# EAGLE design BMS Bottom Segment (EAGLE 7.7.0)
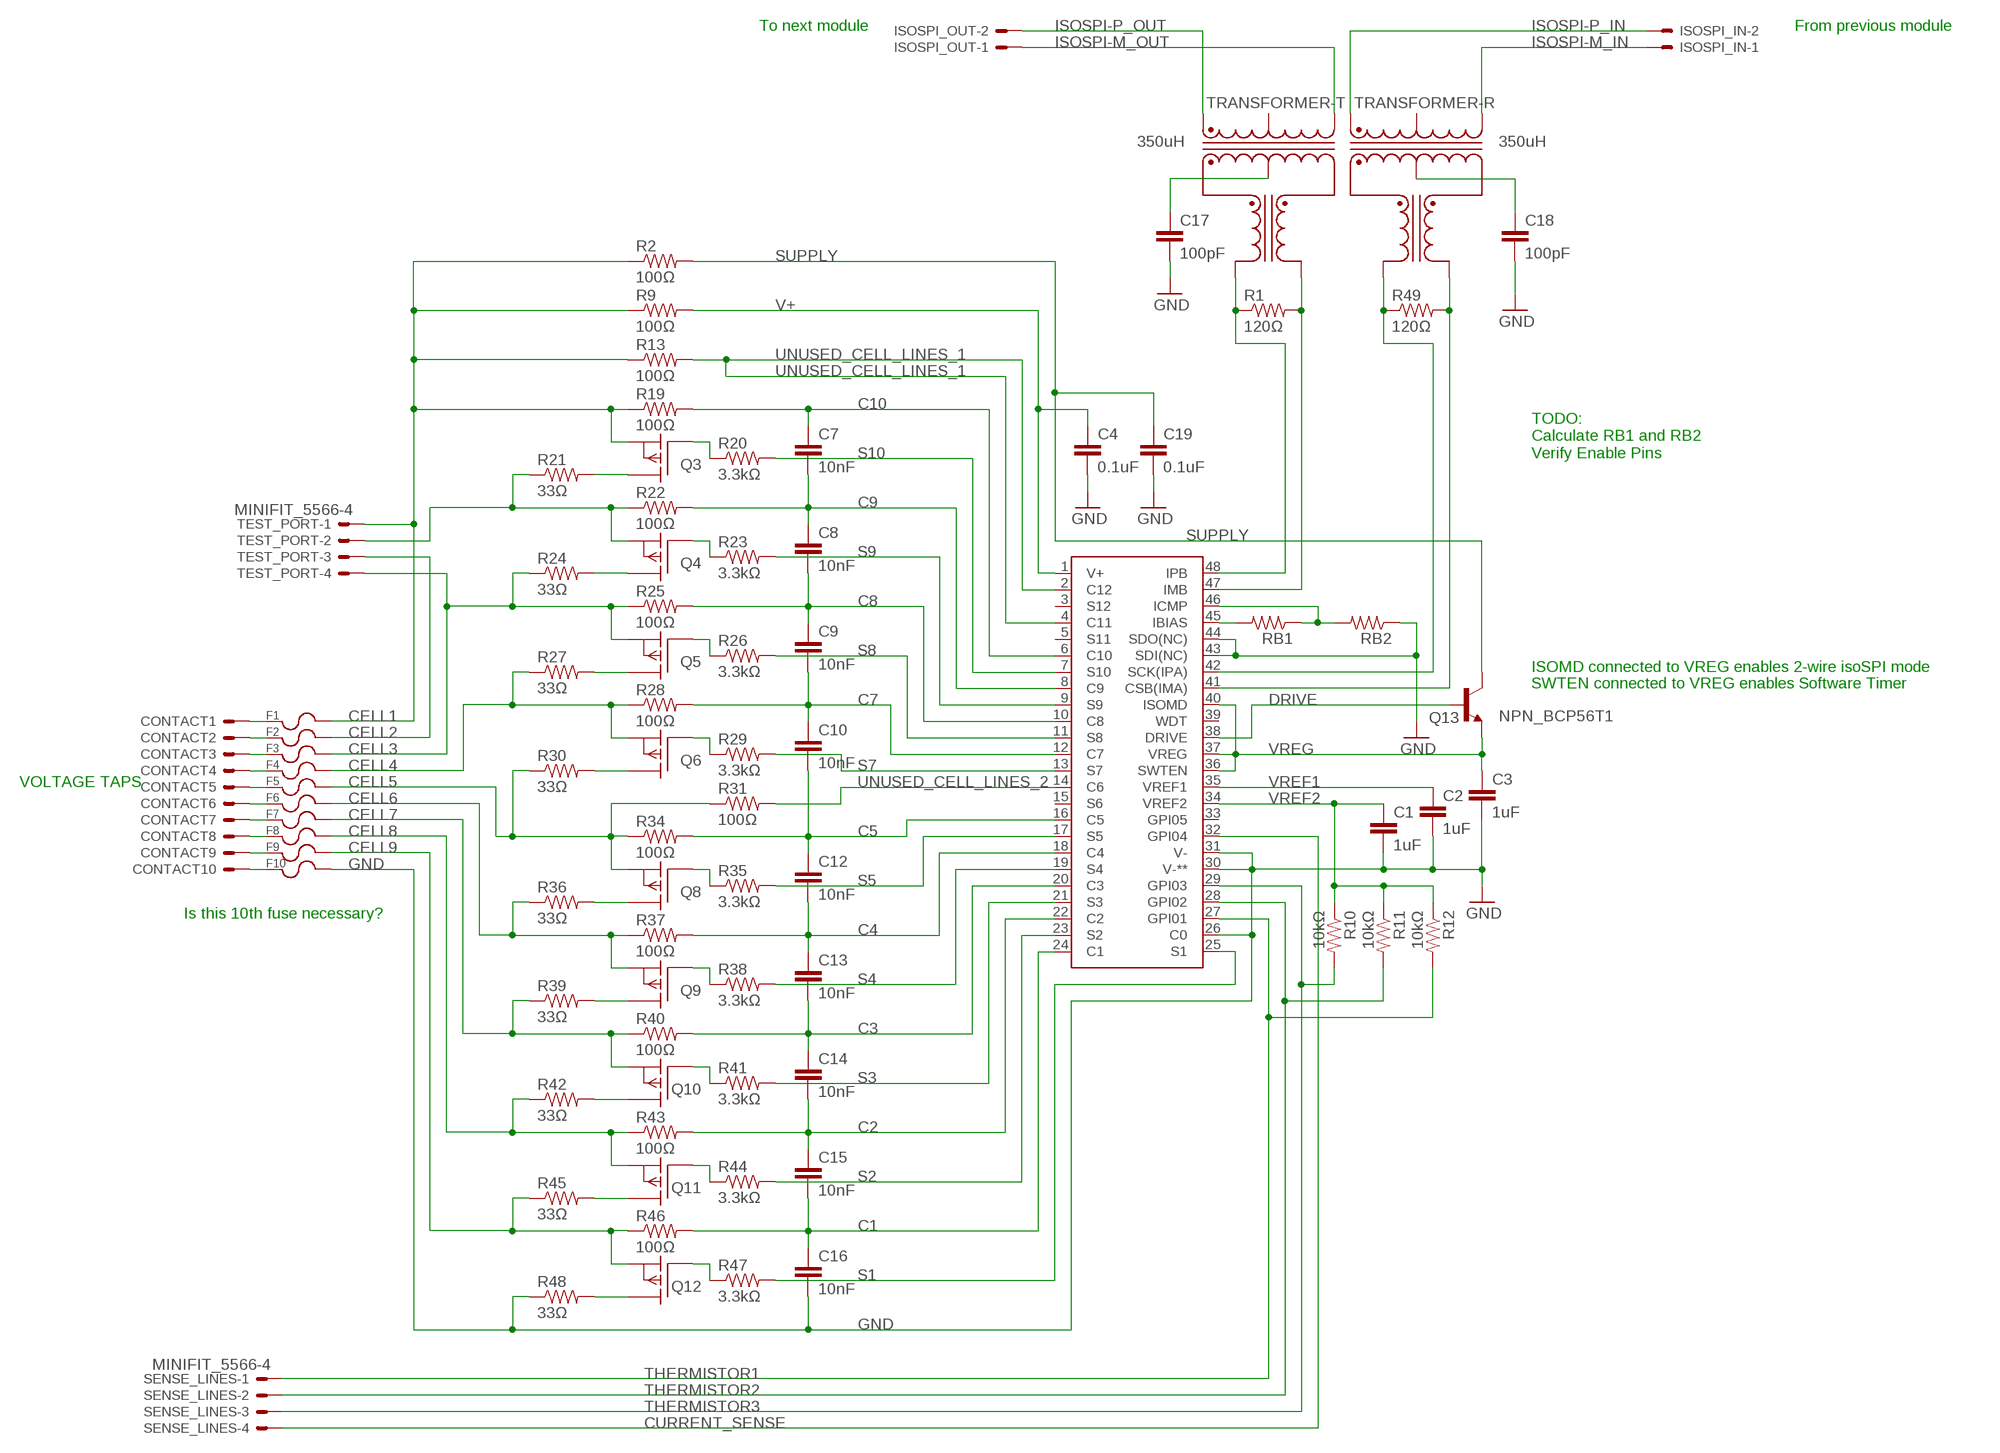
[diagram p0: schematic, sheet 1]

## Parts
C1  1uF  CAP0805  [0805]
C2  1uF  CAP0805  [0805]
C3  1uF  CAP0805  [0805]
C4  0.1uF  CAP0805  [0805]
C7  10nF  CAP0805  [0805]
C8  10nF  CAP0805  [0805]
C9  10nF  CAP0805  [0805]
C10  10nF  CAP0805  [0805]
C12  10nF  CAP0805  [0805]
C13  10nF  CAP0805  [0805]
C14  10nF  CAP0805  [0805]
C15  10nF  CAP0805  [0805]
C16  10nF  CAP0805  [0805]
C17  100pF  CAP0805  [0805]
C18  100pF  CAP0805  [0805]
C19  0.1uF  CAP0805  [0805]
CONTACT1  SPRING_CONTACT  [S1791-42R]
CONTACT2  SPRING_CONTACT  [S1791-42R]
CONTACT3  SPRING_CONTACT  [S1791-42R]
CONTACT4  SPRING_CONTACT  [S1791-42R]
CONTACT5  SPRING_CONTACT  [S1791-42R]
CONTACT6  SPRING_CONTACT  [S1791-42R]
CONTACT7  SPRING_CONTACT  [S1791-42R]
CONTACT8  SPRING_CONTACT  [S1791-42R]
CONTACT9  SPRING_CONTACT  [S1791-42R]
CONTACT10  SPRING_CONTACT  [S1791-42R]
F1  0751.0110_FUSE_CLIP  [0751.0110]
F2  0751.0110_FUSE_CLIP  [0751.0110]
F3  0751.0110_FUSE_CLIP  [0751.0110]
F4  0751.0110_FUSE_CLIP  [0751.0110]
F5  0751.0110_FUSE_CLIP  [0751.0110]
F6  0751.0110_FUSE_CLIP  [0751.0110]
F7  0751.0110_FUSE_CLIP  [0751.0110]
F8  0751.0110_FUSE_CLIP  [0751.0110]
F9  0751.0110_FUSE_CLIP  [0751.0110]
F10  0751.0110_FUSE_CLIP  [0751.0110]
ISOSPI_IN  MINIFIT_5566-2  [MINIFIT_5566-2]
ISOSPI_OUT  MINIFIT_5566-2  [MINIFIT_5566-2]
Q3  P-CHANNEL_MOSFET_DMP3099L-7  [SOT23]
Q4  P-CHANNEL_MOSFET_DMP3099L-7  [SOT23]
Q5  P-CHANNEL_MOSFET_DMP3099L-7  [SOT23]
Q6  P-CHANNEL_MOSFET_DMP3099L-7  [SOT23]
Q8  P-CHANNEL_MOSFET_DMP3099L-7  [SOT23]
Q9  P-CHANNEL_MOSFET_DMP3099L-7  [SOT23]
Q10  P-CHANNEL_MOSFET_DMP3099L-7  [SOT23]
Q11  P-CHANNEL_MOSFET_DMP3099L-7  [SOT23]
Q12  P-CHANNEL_MOSFET_DMP3099L-7  [SOT23]
Q13  NPN_BCP56T1  [SOT223]
R1  120Ω  RESISTOR0805-RES  [0805]
R2  100Ω  RESISTOR0805-RES  [0805]
R9  100Ω  RESISTOR0805-RES  [0805]
R10  10kΩ  RESISTOR0805-RES  [0805]
R11  10kΩ  RESISTOR0805-RES  [0805]
R12  10kΩ  RESISTOR0805-RES  [0805]
R13  100Ω  RESISTOR0805-RES  [0805]
R19  100Ω  RESISTOR0805-RES  [0805]
R20  3.3kΩ  RESISTOR0805-RES  [0805]
R21  33Ω  RESISTOR2512  [R2512]
R22  100Ω  RESISTOR0805-RES  [0805]
R23  3.3kΩ  RESISTOR0805-RES  [0805]
R24  33Ω  RESISTOR2512  [R2512]
R25  100Ω  RESISTOR0805-RES  [0805]
R26  3.3kΩ  RESISTOR0805-RES  [0805]
R27  33Ω  RESISTOR2512  [R2512]
R28  100Ω  RESISTOR0805-RES  [0805]
R29  3.3kΩ  RESISTOR0805-RES  [0805]
R30  33Ω  RESISTOR2512  [R2512]
R31  100Ω  RESISTOR0805-RES  [0805]
R34  100Ω  RESISTOR0805-RES  [0805]
R35  3.3kΩ  RESISTOR0805-RES  [0805]
R36  33Ω  RESISTOR2512  [R2512]
R37  100Ω  RESISTOR0805-RES  [0805]
R38  3.3kΩ  RESISTOR0805-RES  [0805]
R39  33Ω  RESISTOR2512  [R2512]
R40  100Ω  RESISTOR0805-RES  [0805]
R41  3.3kΩ  RESISTOR0805-RES  [0805]
R42  33Ω  RESISTOR2512  [R2512]
R43  100Ω  RESISTOR0805-RES  [0805]
R44  3.3kΩ  RESISTOR0805-RES  [0805]
R45  33Ω  RESISTOR2512  [R2512]
R46  100Ω  RESISTOR0805-RES  [0805]
R47  3.3kΩ  RESISTOR0805-RES  [0805]
R48  33Ω  RESISTOR2512  [R2512]
R49  120Ω  RESISTOR0805-RES  [0805]
RB1  RESISTOR0805-RES  [0805]
RB2  RESISTOR0805-RES  [0805]
SENSE_LINES  MINIFIT_5566-4  [MINIFIT_5566-4]
TEST_PORT  MINIFIT_5566-4  [MINIFIT_5566-4]
TRANSFORMER-  350uH  TRANSFORMER_749010013  [749010013]
U$2  LTC6804-1  [LTC6804]

## Nets
C1: C15.2 C16.1 R46.2 U$2.24(C1)
C2: C14.2 C15.1 R43.2 U$2.22(C2)
C3: C13.2 C14.1 R40.2 U$2.20(C3)
C4: C12.2 C13.1 R37.2 U$2.18(C4)
C5: C10.2 C12.1 R34.2 U$2.16(C5)
C7: C9.2 C10.1 R28.2 U$2.12(C7)
C8: C8.2 C9.1 R25.2 U$2.10(C8)
C9: C7.2 C8.1 R22.2 U$2.8(C9)
C10: C7.1 R19.2 U$2.6(C10)
CELL1: F1.R1 F1.R2 Q3.2(S) R2.1 R9.1 R13.1 R19.1 TEST_PORT.1
CELL2: F2.R1 F2.R2 Q4.2(S) R21.1 R22.1 TEST_PORT.2 TEST_PORT.3
CELL3: F3.R1 F3.R2 Q5.2(S) R24.1 R25.1 TEST_PORT.4
CELL4: F4.R1 F4.R2 Q6.2(S) R27.1 R28.1
CELL5: F5.R1 F5.R2 Q8.2(S) R30.1 R31.1 R34.1
CELL6: F6.R1 F6.R2 Q9.2(S) R36.1 R37.1
CELL7: F7.R1 F7.R2 Q10.2(S) R39.1 R40.1
CELL8: F8.R1 F8.R2 Q11.2(S) R42.1 R43.1
CELL9: F9.R1 F9.R2 Q12.2(S) R45.1 R46.1
CURRENT_SENSE: SENSE_LINES.4 U$2.32(GPI04)
DRIVE: Q13.1(BASE) U$2.38(DRIVE)
GND: C1.2 C2.2 C3.2 C4.2 C16.2 C17.2 C18.2 C19.2 F10.R1 F10.R2 R48.1 RB2.1 U$2.26(C0) U$2.30(V-**) U$2.31(V-) U$2.43(SDI(NC)) U$2.44(SDO(NC))
ISOSPI-M_IN: ISOSPI_IN.1 TRANSFORMER-.8(R:D-)
ISOSPI-M_OUT: ISOSPI_OUT.1 TRANSFORMER-.3(T:D-)
ISOSPI-P_IN: ISOSPI_IN.2 TRANSFORMER-.6(R:D+)
ISOSPI-P_OUT: ISOSPI_OUT.2 TRANSFORMER-.1(T:D+)
N$1: C18.1 TRANSFORMER-.10(R:CX)
N$2: C17.1 TRANSFORMER-.15(T:CX)
N$4: RB1.2 U$2.45(IBIAS)
N$5: R1.1 TRANSFORMER-.16(T:X+) U$2.48(IPB)
N$7: RB1.1 RB2.2 U$2.46(ICMP)
N$8: R49.1 TRANSFORMER-.11(R:X+) U$2.42(SCK(IPA))
N$9: R49.2 TRANSFORMER-.9(R:X-) U$2.41(CSB(IMA))
N$14: CONTACT1.P$1(S) F1.L1 F1.L2
N$15: Q3.1(G) R20.1
N$16: CONTACT2.P$1(S) F2.L1 F2.L2
N$17: CONTACT3.P$1(S) F3.L1 F3.L2
N$18: Q3.3(D) R21.2
N$19: CONTACT4.P$1(S) F4.L1 F4.L2
N$20: Q8.1(G) R35.1
N$22: Q9.1(G) R38.1
N$23: CONTACT5.P$1(S) F5.L1 F5.L2
N$24: CONTACT6.P$1(S) F6.L1 F6.L2
N$25: Q4.3(D) R24.2
N$26: CONTACT7.P$1(S) F7.L1 F7.L2
N$27: Q10.1(G) R41.1
N$28: Q11.1(G) R44.1
N$29: Q12.1(G) R47.1
N$30: Q5.3(D) R27.2
N$31: CONTACT8.P$1(S) F8.L1 F8.L2
N$32: CONTACT9.P$1(S) F9.L1 F9.L2
N$33: CONTACT10.P$1(S) F10.L1 F10.L2
N$36: Q6.3(D) R30.2
N$42: R1.2 TRANSFORMER-.14(T:X-) U$2.47(IMB)
N$43: Q8.3(D) R36.2
N$51: Q9.3(D) R39.2
N$53: Q10.3(D) R42.2
N$61: Q11.3(D) R45.2
N$66: Q12.3(D) R48.2
N$68: Q4.1(G) R23.1
N$69: Q5.1(G) R26.1
N$70: Q6.1(G) R29.1
S1: R47.2 U$2.25(S1)
S2: R44.2 U$2.23(S2)
S3: R41.2 U$2.21(S3)
S4: R38.2 U$2.19(S4)
S5: R35.2 U$2.17(S5)
S7: R29.2 U$2.13(S7)
S8: R26.2 U$2.11(S8)
S9: R23.2 U$2.9(S9)
S10: R20.2 U$2.7(S10)
SUPPLY: C19.1 Q13.2(COLLECTOR) Q13.4(COLLECTOR) R2.2
THERMISTOR1: R12.2 SENSE_LINES.1 U$2.27(GPI01)
THERMISTOR2: R11.2 SENSE_LINES.2 U$2.28(GPI02)
THERMISTOR3: R10.2 SENSE_LINES.3 U$2.29(GPI03)
UNUSED_CELL_LINES_1: R13.2 U$2.2(C12) U$2.4(C11)
UNUSED_CELL_LINES_2: R31.2 U$2.14(C6)
V+: C4.1 R9.2 U$2.1(V+)
VREF1: C2.1 U$2.35(VREF1)
VREF2: C1.1 R10.1 R11.1 R12.1 U$2.34(VREF2)
VREG: C3.1 Q13.3(EMITTER) U$2.36(SWTEN) U$2.37(VREG) U$2.40(ISOMD)
Unconnected: TRANSFORMER-.2(T:CD) TRANSFORMER-.7(R:CD) U$2.3(S12) U$2.5(S11) U$2.15(S6) U$2.33(GPI05) U$2.39(WDT)

## Notes on the sheet
- To next module | From previous module
- TODO:
  Calculate RB1 and RB2
  Verify Enable Pins
- ISOMD connected to VREG enables 2-wire isoSPI mode
- SWTEN connected to VREG enables Software Timer
- VOLTAGE TAPS
- Is this 10th fuse necessary?

## Library data of the parts
C1-C4 C7-C10 C12-C19 = HyTechDevices:CAP: Capacitor Standard 0603 ceramic capacitor, and 0.1" leaded capacitor.
CONTACT1-CONTACT10 = HyTechDevices:SPRING_CONTACT: Harwin Surface Mount Spring Contact Datasheet <http://www.mouser.com/ds/2/181/S1791-42R-351038.pdf>
F1-F10 = HyTechDevices:0751.0110_FUSE_CLIP: Schurter 0751.0110 Brass Fuse Clip Datasheet <http://www.mouser.com/ds/2/358/typ_OG__Clip__5x20-2553.pdf>
ISOSPI_IN ISOSPI_OUT = HyTechDevices:MINIFIT_5566-2: Mini-Fit Junior connector 2 pole Source: http://www.molex.com; OC_FARNELL: 1822072; OC_NEWARK: unknown
Q3-Q6 Q8-Q12 = HyTechDevices:P-CHANNEL_MOSFET_DMP3099L-7: Diodes Incorporated P-Channel Enhancement Mode MOSFET Datasheet <http://www.mouser.com/ds/2/115/DMP3099L-266220.pdf>
Q13 = HyTechDevices:NPN_BCP56T1: ON Semiconductor BCP56 Series NPN Silicon Epitaxial Transistor Datasheet <http://www.mouser.com/ds/2/308/BCP56T1-D-104805.pdf>
R1 R2 R9-R13 R19-R31 R34-R49 RB1 RB2 = HyTechDevices:RESISTOR: Resistor Basic schematic elements and footprints for 0603, 1206, and PTH resistors.
SENSE_LINES TEST_PORT = HyTechDevices:MINIFIT_5566-4: Mini-Fit Junior connector 4 pole Source: http://www.molex.com; OC_FARNELL: unknown; OC_NEWARK: unknown
TRANSFORMER- = HyTechDevices:TRANSFORMER_749010013: Wurth Electronics Midcom 749010013 10/100BaseTX Ethernet Transformer Datasheet <http://www.mouser.com/ds/2/445/749010013-311000.pdf> Mouser Page <http://www.mouser.com/ProductDetail/Wurth-Electronics-Midcom/749010013/?qs=40TFAHZMFvcjCZphxWYgVw%3D%3D>
U$2 = HyTechDevices:LTC6804-1: Linear Technology LTC6804-1 Multicell Battery Monitor Datasheet <http://cds.linear.com/docs/en/datasheet/680412fc.pdf>

## Board
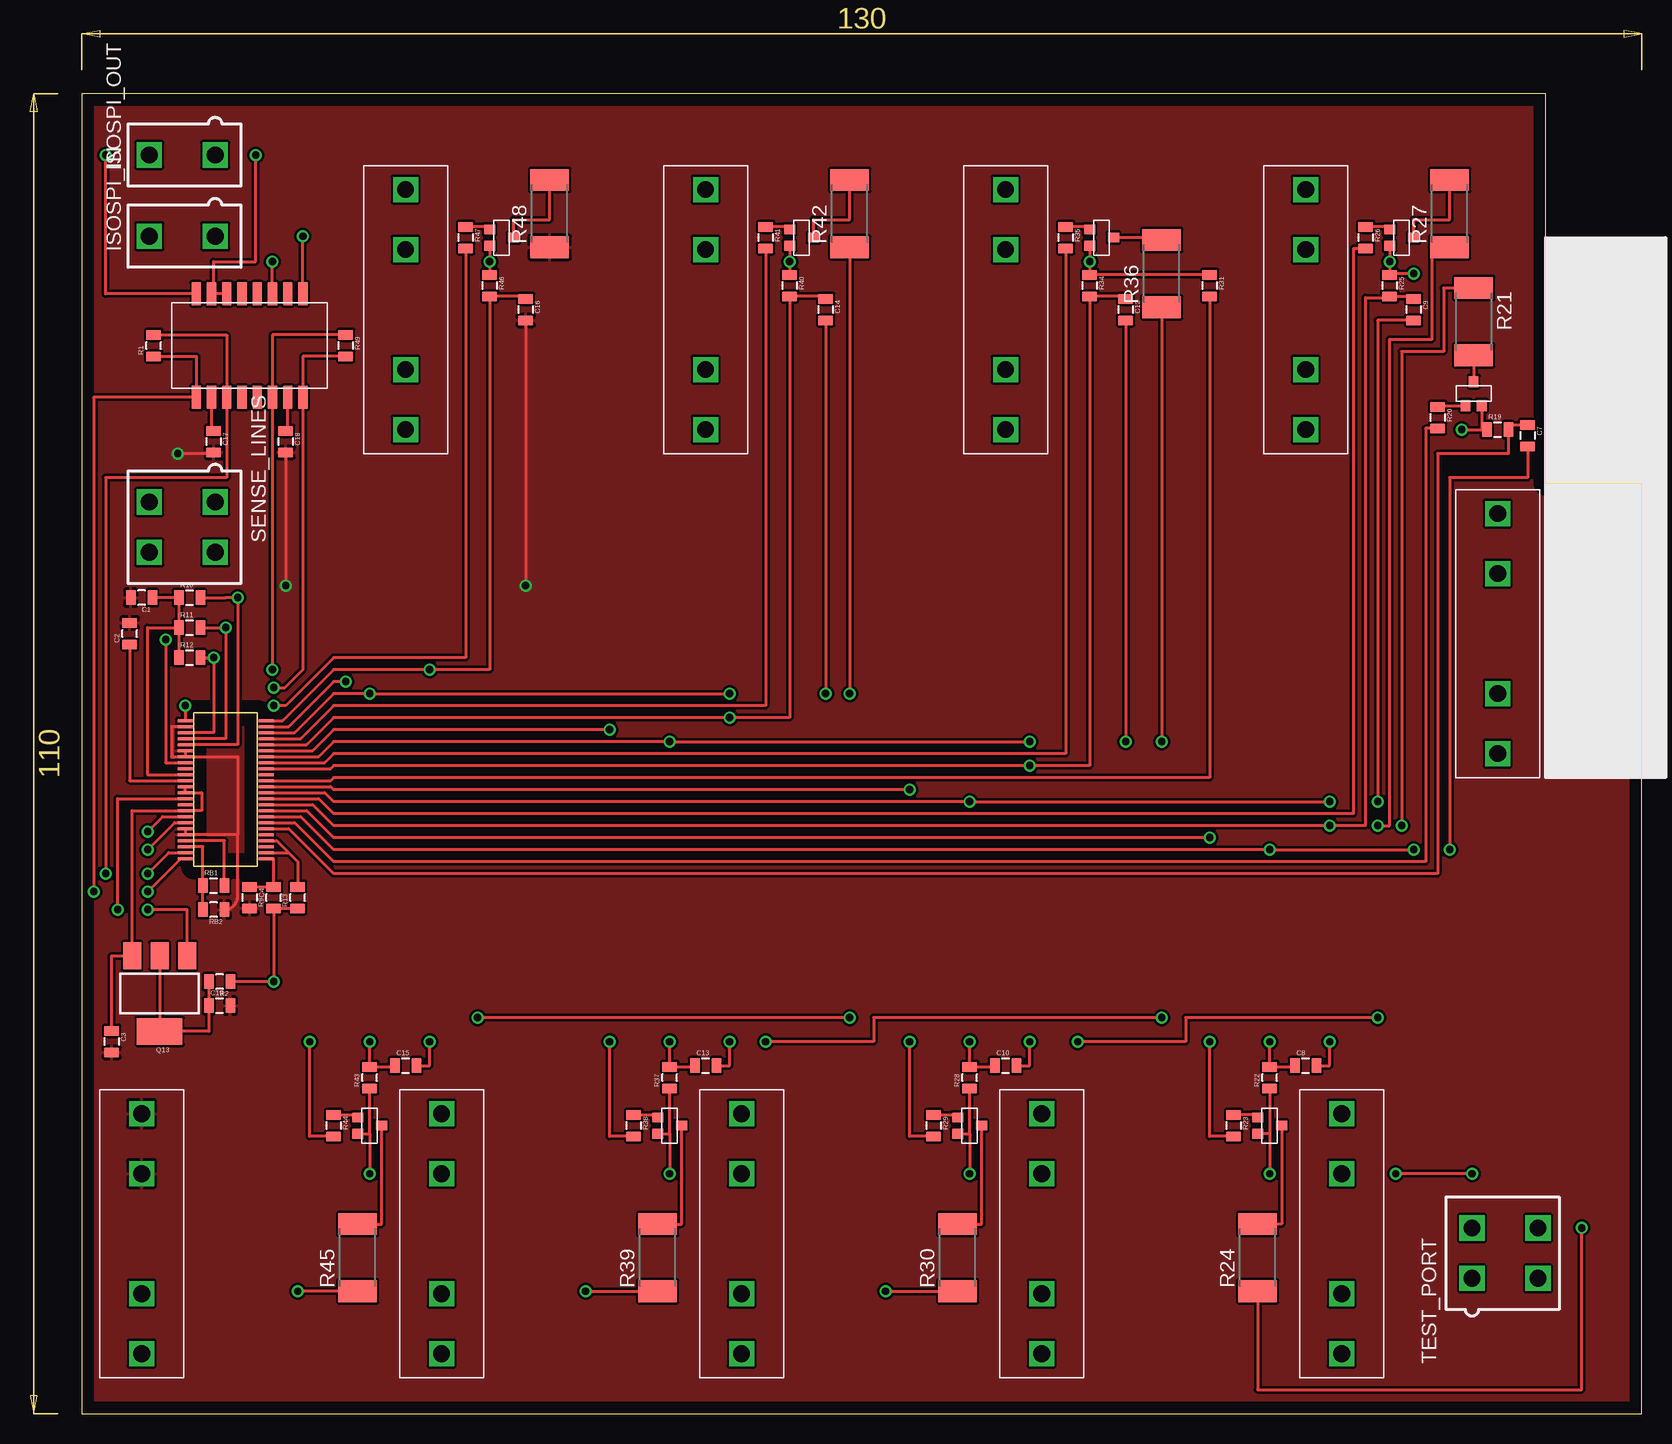
[diagram p1: board, top side]
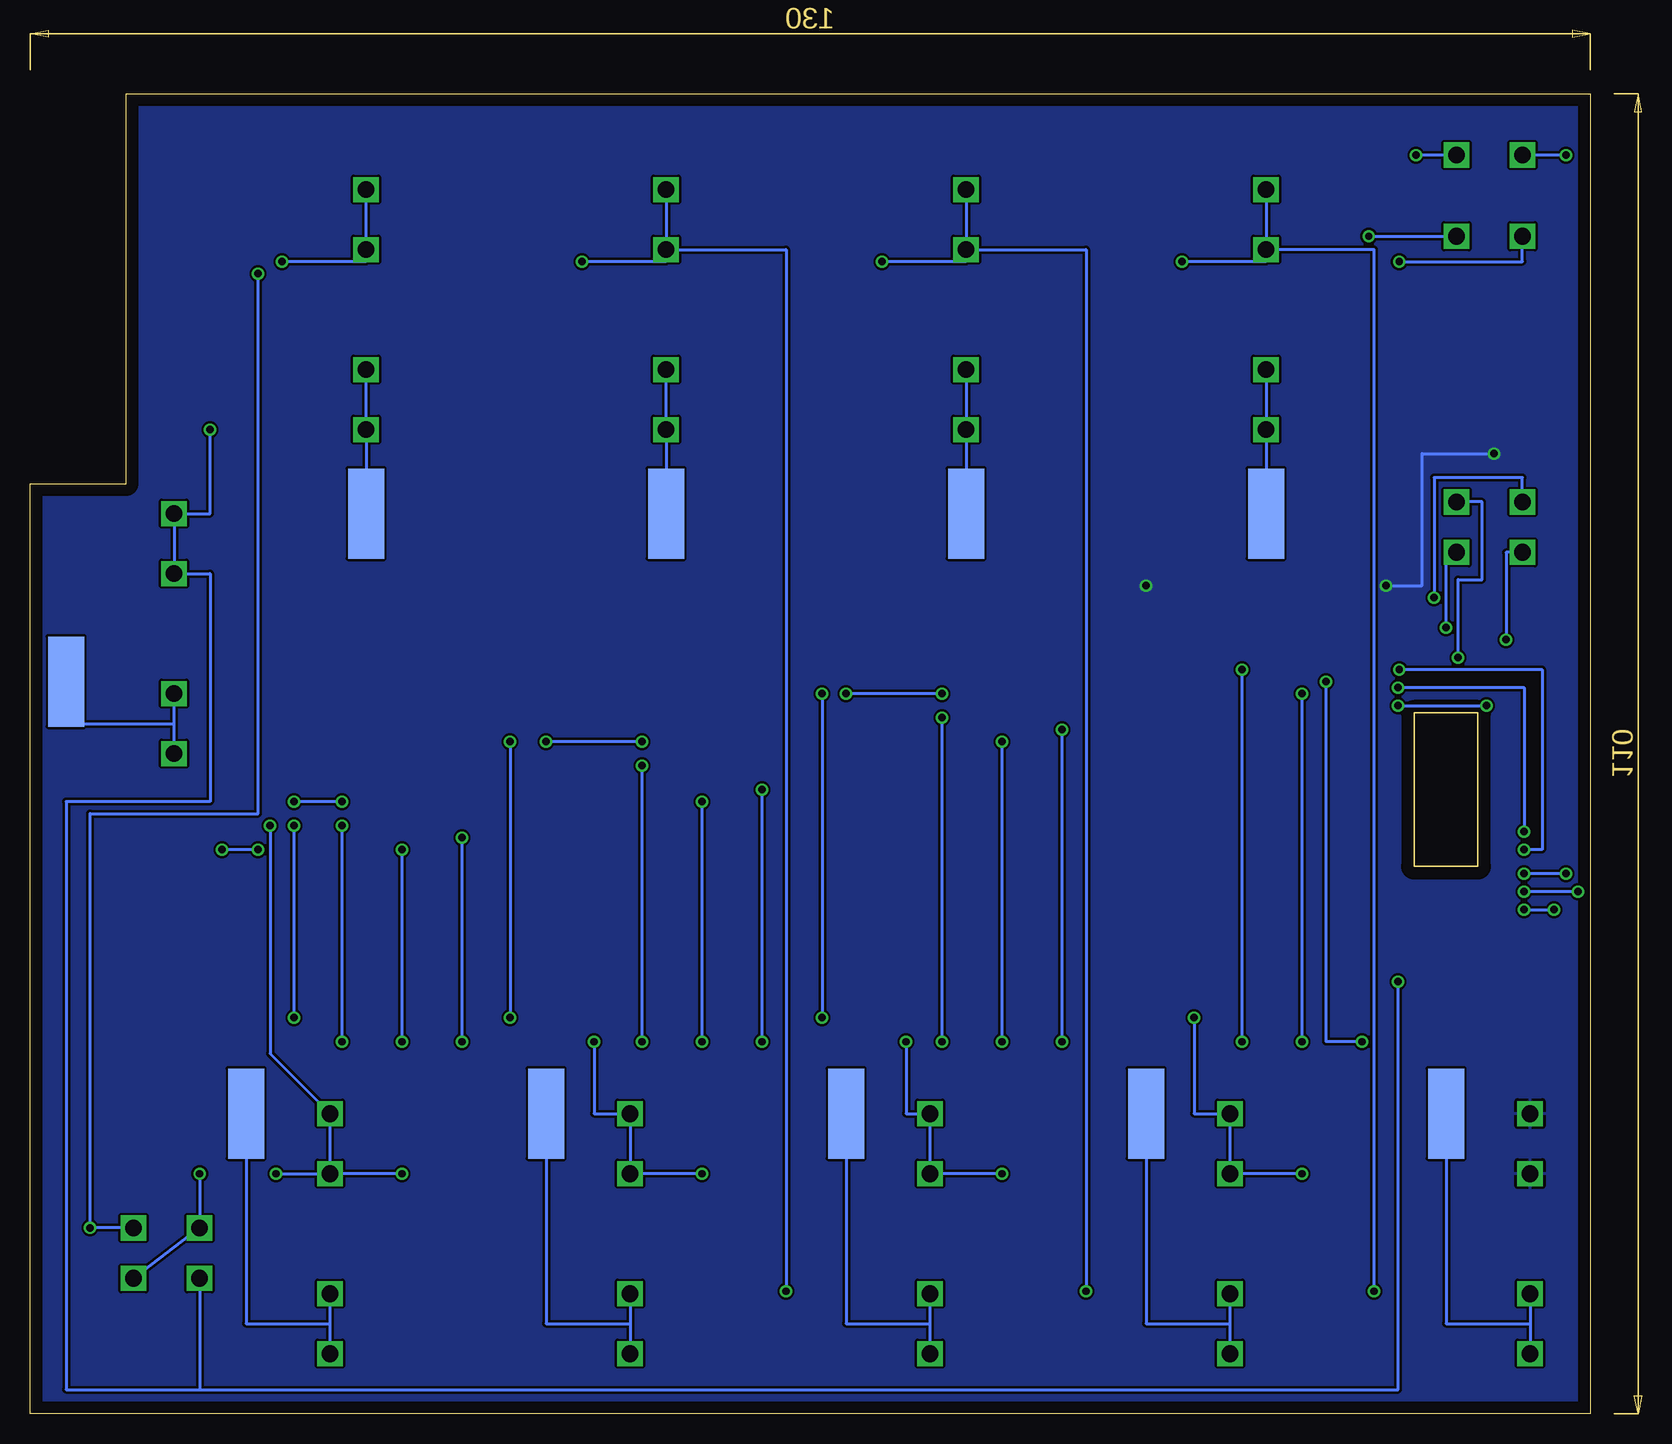
[diagram p2: board, bottom side, seen from below]

Size 130 x 110 mm. Coordinates in mm from the lower left corner, seen from the top.
Outline: 0,0 130,0 130,77.5 122,77.5 122,110 0,110 0,0
Copper layers (1*16): Top 0.035mm / dielectric 1.5mm / Bottom 0.035mm
Design rules "default": minimum track width 10mil, minimum drill 24mil, track to track 8mil, track to pad 8mil, pad to pad 8mil, via to via 8mil, smd to smd 8mil, copper to edge 40mil, drill to drill 8mil, minimum pad ring 10mil, minimum via ring 8mil, stop-mask expansion 4mil, vias tented up to drill 0mil, thermal gap 10mil

### Footprints (pad centres in the part's own frame; a part is rotated, then mirrored left to right if it is on the bottom)
0805 = smd 0.8 x 1.2: 1 -0.9,0; 2 0.9,0
S1791-42R = smd 7.5 x 3: P$1 0,0
0751.0110 = drill 1.4 square: L1 -10,0; L2 -5,0; R1 5,0; R2 10,0
MINIFIT_5566-2 = drill 1.4 square: 1 0,-2.75; 2 0,2.75
SOT23 = smd 0.8 x 0.9: 1 -0.675,-1; 2 0.675,-1; 3 0,1
SOT223 = smd 1.5 x 2.235: 1 -2.3,-3.15; 2 0,-3.15; 3 2.3,-3.15 | smd 3.8 x 2.2: 4 0,3.15
R2512 = smd 1.8 x 3.2: 1 -2.8,0; 2 2.8,0
MINIFIT_5566-4 = drill 1.4 square: 1 2.1,-2.75; 2 -2.1,-2.75; 3 2.1,2.75; 4 -2.1,2.75
749010013 = smd 1.905 x 0.762: 1 4.318,4.445; 2 4.318,3.175; 3 4.318,1.905; 4 4.318,0.635; 5 4.318,-0.635; 6 4.318,-1.905; 7 4.318,-3.175; 8 4.318,-4.445; 9 -4.318,-4.445; 10 -4.318,-3.175; 11 -4.318,-1.905; 12 -4.318,-0.635; 13 -4.318,0.635; 14 -4.318,1.905; 15 -4.318,3.175; 16 -4.318,4.445
LTC6804 = smd 0.25 x 1.25: 1 -5.75,-3.375; 2 -5.25,-3.375; 3 -4.75,-3.375; 4 -4.25,-3.375; 5 -3.75,-3.375; 6 -3.25,-3.375; 7 -2.75,-3.375; 8 -2.25,-3.375; 9 -1.75,-3.375; 10 -1.25,-3.375; 11 -0.75,-3.375; 12 -0.25,-3.375; 13 0.25,-3.375; 14 0.75,-3.375; 15 1.25,-3.375; 16 1.75,-3.375; 17 2.25,-3.375; 18 2.75,-3.375; 19 3.25,-3.375; 20 3.75,-3.375; 21 4.25,-3.375; 22 4.75,-3.375; 23 5.25,-3.375; 24 5.75,-3.375; 25 5.75,3.375; 26 5.25,3.375; 27 4.75,3.375; 28 4.25,3.375; 29 3.75,3.375; 30 3.25,3.375; 31 2.75,3.375; 32 2.25,3.375; 33 1.75,3.375; 34 1.25,3.375; 35 0.75,3.375; 36 0.25,3.375; 37 -0.25,3.375; 38 -0.75,3.375; 39 -1.25,3.375; 40 -1.75,3.375; 41 -2.25,3.375; 42 -2.75,3.375; 43 -3.25,3.375; 44 -3.75,3.375; 45 -4.25,3.375; 46 -4.75,3.375; 47 -5.25,3.375; 48 -5.75,3.375

### Placement (x,y rotation side)
C1  5,68 180 top
C2  4,65 90 top
C3  2.5,31 270 top
C4  14,43 270 top
C7  120.5,81.5 270 top
C8  102,29 0 top
C9  111,92 270 top
C10  77,29 0 top
C12  87,92 270 top
C13  52,29 0 top
C14  62,92 270 top
C15  27,29 0 top
C16  37,92 270 top
C17  11,81 270 top
C18  17,81 270 top
C19  11.5,34 0 top
CONTACT1  127,61 90 bottom
CONTACT2  112,25 90 bottom
CONTACT3  102,75 90 bottom
CONTACT4  87,25 90 bottom
CONTACT5  77,75 90 bottom
CONTACT6  62,25 90 bottom
CONTACT7  52,75 90 bottom
CONTACT8  37,25 90 bottom
CONTACT9  27,75 90 bottom
CONTACT10  12,25 270 bottom
F1  118,65 90 top
F2  105,15 90 top
F3  102,92 90 top
F4  80,15 90 top
F5  77,92 90 top
F6  55,15 90 top
F7  52,92 90 top
F8  30,15 90 top
F9  27,92 90 top
F10  5,15 90 top
ISOSPI_IN  8.38,98.12 90 top
ISOSPI_OUT  8.38,104.88 90 top
Q3  116,85 0 top
Q4  99,24 270 top
Q5  110,98 270 top
Q6  74,24 270 top
Q8  85,98 270 top
Q9  49,24 270 top
Q10  60,98 270 top
Q11  24,24 270 top
Q12  35,98 270 top
Q13  6.5,35 180 top
R1  6,89 90 top
R2  11.5,36 180 top
R9  16,43 90 top
R10  9,68 0 top
R11  9,65.5 0 top
R12  9,63 0 top
R13  18,43 90 top
R19  118,82 0 top
R20  113,83 270 top
R21  116,91 270 top
R22  99,28 90 top
R23  96,24 270 top
R24  98,13 90 top
R25  109,94 270 top
R26  107,98 270 top
R27  114,100 90 top
R28  74,28 90 top
R29  71,24 270 top
R30  73,13 90 top
R31  94,94 270 top
R34  84,94 270 top
R35  82,98 270 top
R36  90,95 90 top
R37  49,28 90 top
R38  46,24 270 top
R39  48,13 90 top
R40  59,94 270 top
R41  57,98 270 top
R42  64,100 90 top
R43  24,28 90 top
R44  21,24 270 top
R45  23,13 90 top
R46  34,94 270 top
R47  32,98 270 top
R48  39,100 90 top
R49  22,89 270 top
RB1  11,44 0 top
RB2  11,42 180 top
SENSE_LINES  8.38,73.87 90 top
TEST_PORT  118.62,13.37 270 top
TRANSFORMER-  14,89 90 top
U$2  12,52 90 top

### Tracks (layer width: path | path; a pad name or v marks a point on that pad's centre or on a via)
C1  (via drill 0.6)
  Top 0.254: U$2.24 16.75,57.75 21,62 v29,62 34,62 R46.2 37,93.1 C16.1 | C15.2 29,29 v29,31
  Bottom 0.254: v29,31 v29,62
C2  (via drill 0.6)
  Top 0.254: v24,31 R43.2 26.1,28.9 C15.1 | U$2.22 17.75,56.75 21,60 v24,60 v54,60 | C14.2 v62,60
  Bottom 0.254: v24,31 v24,60 | v54,60 v62,60
C3  (via drill 0.6)
  Top 0.254: U$2.20 18.75,55.75 21,58 v54,58 59,58 R40.2 62,93.1 C14.1 | C13.2 54,29 v54,31
  Bottom 0.254: v54,31 v54,58
C4  (via drill 0.6)
  Top 0.254: v49,31 R37.2 51.1,28.9 C13.1 | U$2.18 19.75,54.75 21,56 v49,56 v79,56 | C12.2 v87,56
  Bottom 0.254: v49,31 v49,56 | v79,56 v87,56
C5  (via drill 0.6)
  Top 0.254: U$2.16 20.75,53.75 21,54 v79,54 84,54 R34.2 87,93.1 C12.1 | C10.2 79,29 v79,31
  Bottom 0.254: v79,31 v79,54
C7  (via drill 0.6)
  Top 0.254: v74,31 R28.2 76.1,28.9 C10.1 | U$2.12 20.25,51.75 21,51 v74,51 v104,51 | C9.2 108,91.1 v108,51
  Bottom 0.254: v74,31 v74,51 | v104,51 v108,51
C8  (via drill 0.6)
  Top 0.254: U$2.10 19.25,50.75 21,49 v104,49 107,49 107,93 109,93 R25.2 111,93.1 C9.1 | C8.2 104,29 v104,31
  Bottom 0.254: v104,31 v104,49
C9  (via drill 0.6)
  Top 0.254: v99,31 R22.2 101.1,28.9 C8.1 | U$2.8 18.25,49.75 21,47 v99,47 v111,47 | C7.2 120.5,78 114,78 v114,47
  Bottom 0.254: v99,31 v99,47 | v111,47 v114,47
C10
  Top 0.254: U$2.6 17.25,48.75 21,45 113,45 113,80 118.9,80 R19.2 119,82 119,82.4 C7.1
CELL1  (via drill 0.6)
  Top 0.254: R2.1 v16,36 R9.1 R13.1 | Q3.2 116.67,82 R19.1 v115,82
  Bottom 0.254: TEST_PORT.1 115.87,2 | 115.87,2 16,2 v16,36 | v115,82 115,75 F1.R2 F1.R1 115,70 115,51 127,51 127,2 115.87,2
CELL2  (via drill 0.6)
  Top 0.254: R22.1 99,23.32 | 99,23.32 Q4.2 | 99,23.32 v99,20 | v115.87,20 v109.5,20 | R21.1 113.5,93.8 113.5,88.5 110,88.5 v110,49
  Bottom 0.254: F2.R1 F2.R2 110,30 v110,49 | v99,20 F2.R1 | TEST_PORT.3 TEST_PORT.2 v115.87,20 | v109.5,20 F2.R1
CELL3  (via drill 0.6)
  Top 0.254: Q5.2 v109,96 R25.1 109,95 v111,95 | R24.1 98,2 125,2 v125,15.47
  Bottom 0.254: F3.R2 F3.R1 102,96 v109,96 | TEST_PORT.4 v125,15.47 125,50 111,50 v111,95
CELL4  (via drill 0.6)
  Top 0.254: Q6.2 74,23.32 | 74,23.32 R28.1 | 74,23.32 v74,20 | R27.1 112.5,97.2 112.5,89.5 109,89.5 109,49 v108,49 | v108,33 92,33 92,31 v83,31
  Bottom 0.254: v74,20 F4.R1 F4.R2 83,25 v83,31 | v108,33 v108,49
CELL5  (via drill 0.6)
  Top 0.254: Q8.2 v84,96 R34.1 R31.1 | v67,10.2 R30.1
  Bottom 0.254: F5.R2 F5.R1 | F5.R1 67,97 v67,10.2 | F5.R1 77,96 v84,96
CELL6  (via drill 0.6)
  Top 0.254: Q9.2 49,23.32 | 49,23.32 R37.1 | 49,23.32 v49,20 | R36.1 v90,56 | v90,33 66,33 66,31 v57,31
  Bottom 0.254: v49,20 F6.R1 F6.R2 57,25 v57,31 | v90,56 v90,33
CELL7  (via drill 0.6)
  Top 0.254: Q10.2 v59,96 59,95 R40.1 | v42,10.2 R39.1
  Bottom 0.254: F7.R2 F7.R1 | F7.R1 42,97 v42,10.2 | F7.R1 52,96 v59,96
CELL8  (via drill 0.6)
  Top 0.254: Q11.2 24,23.32 | 24,23.32 R43.1 | 24,23.32 v24,20 | R42.1 v64,60 | v64,33 v33,33
  Bottom 0.254: v24,20 F8.R1 F8.R2 33,25 v33,33 | v64,60 v64,33
CELL9  (via drill 0.6)
  Top 0.254: Q12.2 v34,96 R46.1 | R45.1 v18,10.2
  Bottom 0.254: F9.R2 F9.R1 | F9.R1 27,96 v34,96 | v18,10.2 18,97 F9.R1
CURRENT_SENSE  (via drill 0.6)
  Top 0.254: v7,64.5 7,54.25 U$2.32
  Bottom 0.254: SENSE_LINES.4 7,71.77 v7,64.5
DRIVE  (via drill 0.6)
  Top 0.254: Q13.1 8.8,42 v5.5,42 | v3,42 3,51.25 U$2.38
  Bottom 0.254: v5.5,42 v3,42
GND  (via drill 0.6)
  Top 0.254: C17.2 11,80 v8,80 | C18.2 v17,69 | C16.2 v37,69 | RB2.1 arc90 13,43.1 13,48.25 | 13,48.25 U$2.44 U$2.43 | U$2.31 13,54.75 13,48.25 | U$2.26 7.5,57.25 7.5,54.75 U$2.31 | U$2.30 U$2.31
  Bottom 0.254: v17,69 14,69 14,80 v8,80
  pour Top: -1,111 -1,-1 131,-1 131,111
  pour Bottom: -2,-2 -2,112 132,112 132,-2
ISOSPI-M_IN  (via drill 0.6)
  Top 0.254: TRANSFORMER-.8 v18.45,98.12
  Bottom 0.254: v18.45,98.12 ISOSPI_IN.1
ISOSPI-M_OUT  (via drill 0.6)
  Top 0.254: TRANSFORMER-.3 11,93.32 11,96 14.5,96 v14.5,104.88
  Bottom 0.254: ISOSPI_OUT.1 v14.5,104.88
ISOSPI-P_IN  (via drill 0.6)
  Top 0.254: TRANSFORMER-.6 v15.9,96
  Bottom 0.254: v15.9,96 5.63,96 ISOSPI_IN.2
ISOSPI-P_OUT  (via drill 0.6)
  Top 0.254: TRANSFORMER-.1 2,93.32 v2,104.88
  Bottom 0.254: v2,104.88 ISOSPI_OUT.2
N$1
  Top 0.254: C18.1 17.18,81.9 TRANSFORMER-.10
N$2
  Top 0.254: C17.1 10.82,81.9 TRANSFORMER-.15
N$4
  Top 0.254: RB1.2 11.9,47.75 U$2.45
N$5  (via drill 0.6)
  Top 0.254: R1.1 9.55,88.1 TRANSFORMER-.16 1,84.68 v1,43.5 | v5.5,43.5 8.25,46.25 U$2.48
  Bottom 0.254: v1,43.5 v5.5,43.5
N$7
  Top 0.254: RB2.2 RB1.1 10.1,47.25 U$2.46
N$8  (via drill 0.6)
  Top 0.254: R49.1 15.9,89.9 TRANSFORMER-.11 v15.9,62 | v5.5,47 7.75,49.25 U$2.42
  Bottom 0.254: v5.5,47 4,47 4,62 v15.9,62
N$9  (via drill 0.6)
  Top 0.254: R49.2 18.45,88.1 TRANSFORMER-.9 18.45,62 16.95,60.5 v16,60.5 | v5.5,48.5 6.75,49.75 U$2.41
  Bottom 0.254: v5.5,48.5 5.5,60.5 v16,60.5
N$14
  Bottom 0.254: F1.L1 118,57.5 | 118,57.5 F1.L2 | CONTACT1.P$1 127,57.5 118,57.5
N$15
  Top 0.254: R20.1 113,84 Q3.1
N$16
  Bottom 0.254: F2.L1 105,7.5 | 105,7.5 F2.L2 | CONTACT2.P$1 112,7.5 105,7.5
N$17
  Bottom 0.254: F3.L2 F3.L1 CONTACT3.P$1
N$18
  Top 0.254: R21.2 Q3.3
N$19
  Bottom 0.254: F4.L2 80,7.5 | 80,7.5 F4.L1 | CONTACT4.P$1 87,7.5 80,7.5
N$20
  Top 0.254: Q8.1 84,98.9 R35.1
N$22
  Top 0.254: R38.1 48,24.9 Q9.1
N$23
  Bottom 0.254: F5.L2 F5.L1 CONTACT5.P$1
N$24
  Bottom 0.254: F6.L1 55,7.5 | 55,7.5 F6.L2 | CONTACT6.P$1 62,7.5 55,7.5
N$25
  Top 0.254: Q4.3 100,15.8 R24.2
N$26
  Bottom 0.254: F7.L2 F7.L1 CONTACT7.P$1
N$27
  Top 0.254: Q10.1 59,98.9 R41.1
N$28
  Top 0.254: R44.1 23,24.9 Q11.1
N$29
  Top 0.254: Q12.1 34,98.9 R47.1
N$30
  Top 0.254: Q5.3 111,99.5 114,99.5 R27.2
N$31
  Bottom 0.254: F8.L1 30,7.5 | 30,7.5 F8.L2 | CONTACT8.P$1 37,7.5 30,7.5
N$32
  Bottom 0.254: F9.L2 F9.L1 CONTACT9.P$1
N$33
  Bottom 0.254: F10.L2 5,7.5 | 5,7.5 F10.L1 | CONTACT10.P$1 12,7.5 5,7.5
N$36
  Top 0.254: R30.2 75,15.8 Q6.3
N$42  (via drill 0.6)
  Top 0.254: R1.2 12.1,89.9 TRANSFORMER-.14 12.1,78 2,78 v2,45 | v5.5,45 7.25,46.75 U$2.47
  Bottom 0.254: v2,45 v5.5,45
N$43
  Top 0.254: R36.2 90,98 Q8.3
N$51
  Top 0.254: R39.2 50,15.8 Q9.3
N$53
  Top 0.254: Q10.3 61,99.5 64,99.5 R42.2
N$61
  Top 0.254: R45.2 25,15.8 Q11.3
N$66
  Top 0.254: Q12.3 36,99.5 39,99.5 R48.2
N$68
  Top 0.254: Q4.1 98,24.9 R23.1
N$69
  Top 0.254: Q5.1 109,98.9 R26.1
N$70
  Top 0.254: R29.1 73,24.9 Q6.1
S1  (via drill 0.6)
  Top 0.254: R47.2 32,63 21,63 17,59 v16,59 | v8.62,59 U$2.25
  Bottom 0.254: v16,59 v8.62,59
S2  (via drill 0.6)
  Top 0.254: R44.2 19,23.1 v19,31 | v22,61 21,61 17.25,57.25 U$2.23
  Bottom 0.254: v19,31 22,31 v22,61
S3
  Top 0.254: R41.2 57,59 21,59 18.25,56.25 U$2.21
S4  (via drill 0.6)
  Top 0.254: R38.2 44,23.1 v44,31 | v44,57 21,57 19.25,55.25 U$2.19
  Bottom 0.254: v44,31 v44,57
S5
  Top 0.254: R35.2 82,55 21,55 20.25,54.25 U$2.17
S7  (via drill 0.6)
  Top 0.254: R29.2 69,23.1 v69,31 | v69,52 21,52 20.75,52.25 U$2.13
  Bottom 0.254: v69,31 v69,52
S8
  Top 0.254: U$2.11 19.75,51.25 21,50 106,50 106,97.1 R26.2
S9  (via drill 0.6)
  Top 0.254: R23.2 94,23.1 v94,31 | v94,48 21,48 18.75,50.25 U$2.9
  Bottom 0.254: v94,31 v94,48
S10
  Top 0.254: U$2.7 17.75,49.25 21,46 112,46 112,82.1 R20.2
SUPPLY
  Top 0.254: R2.2 C19.1 10.6,31.85 Q13.4 Q13.2
THERMISTOR1  (via drill 0.6)
  Top 0.254: R12.2 v11,63 11,56.75 U$2.27
  Bottom 0.254: v11,63 11,69.5 9,69.5 9,75.97 SENSE_LINES.1
THERMISTOR2  (via drill 0.6)
  Top 0.254: R11.2 v12,65.5 12,65 12,56.25 U$2.28
  Bottom 0.254: v12,65.5 12,71.77 SENSE_LINES.2
THERMISTOR3  (via drill 0.6)
  Top 0.254: R10.2 12,68 v13,68 13,55.75 U$2.29
  Bottom 0.254: SENSE_LINES.3 5.63,78 13,78 v13,68
UNUSED_CELL_LINES_1
  Top 0.254: U$2.4 16.25,47.75 17.25,46.75 | R13.2 18,46 17.25,46.75 | U$2.2 17.25,46.75
UNUSED_CELL_LINES_2
  Top 0.254: R31.2 94,53 21,53 20.75,52.75 U$2.14
V+
  Top 0.254: C4.1 R9.2 16,46.25 U$2.1
VREF1
  Top 0.254: C2.1 4,52.75 U$2.35
VREF2
  Top 0.254: R11.1 R10.1 C1.1 | R11.1 R12.1 | U$2.34 5.5,53.25 5.5,65.5 R11.1
VREG
  Top 0.254: C3.1 2.5,38.15 Q13.3 4.2,50.25 U$2.40 10,50.25 10,51.75 U$2.37 U$2.36